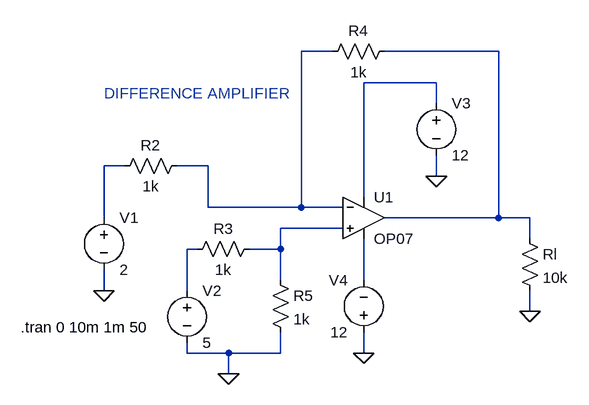
[diagram p0: schematic Difference Amplifier.asc]
Difference Amplifier.asc, the LTspice schematic file:
Version 4
SHEET 1 880 680
WIRE 272 -64 224 -64
WIRE 528 -64 352 -64
WIRE 432 -16 320 -16
WIRE 432 16 432 -16
WIRE -48 112 -80 112
WIRE 80 112 32 112
WIRE 432 128 432 96
WIRE 320 160 320 -16
WIRE 80 176 80 112
WIRE 224 176 224 -64
WIRE 224 176 80 176
WIRE 288 176 224 176
WIRE -80 192 -80 112
WIRE 528 192 528 -64
WIRE 528 192 352 192
WIRE 576 192 528 192
WIRE 288 208 192 208
WIRE 576 224 576 192
WIRE 64 240 48 240
WIRE 192 240 192 208
WIRE 192 240 144 240
WIRE 192 288 192 240
WIRE 320 288 320 224
WIRE -80 304 -80 272
WIRE 48 304 48 240
WIRE 576 336 576 304
WIRE 48 400 48 384
WIRE 112 400 48 400
WIRE 192 400 192 368
WIRE 192 400 112 400
WIRE 320 400 320 368
WIRE 112 432 112 400
FLAG 432 128 0
FLAG 576 336 0
FLAG -80 304 0
FLAG 112 432 0
FLAG 320 400 0
SYMBOL OpAmps\\OP07 320 128 R0
SYMATTR InstName U1
SYMBOL voltage 320 384 R180
WINDOW 0 24 96 Left 2
WINDOW 3 24 16 Left 2
SYMATTR InstName V4
SYMATTR Value 12
SYMBOL voltage 432 0 R0
SYMATTR InstName V3
SYMATTR Value 12
SYMBOL res 560 208 R0
SYMATTR InstName Rl
SYMATTR Value 10k
SYMBOL res 368 -80 R90
WINDOW 0 0 56 VBottom 2
WINDOW 3 32 56 VTop 2
SYMATTR InstName R4
SYMATTR Value 1k
SYMBOL res 160 224 R90
WINDOW 0 0 56 VBottom 2
WINDOW 3 32 56 VTop 2
SYMATTR InstName R3
SYMATTR Value 1k
SYMBOL res 48 96 R90
WINDOW 0 0 56 VBottom 2
WINDOW 3 32 56 VTop 2
SYMATTR InstName R2
SYMATTR Value 1k
SYMBOL voltage -80 176 R0
SYMATTR InstName V1
SYMATTR Value 2
SYMBOL res 176 272 R0
SYMATTR InstName R5
SYMATTR Value 1k
SYMBOL voltage 48 288 R0
SYMATTR InstName V2
SYMATTR Value 5
TEXT -208 360 Left 2 !.tran 0 10m 1m 50
TEXT -80 0 Left 2 ;DIFFERENCE AMPLIFIER

The netlist it stands for:
* Difference Amplifier.asc
XU1 N005 N001 N003 N007 N002 LT1001  ; OP07, pins In+ In- V+ V- OUT
V4 0 N007 12
V3 N003 0 12
Rl N002 0 10k
R4 N002 N001 1k
R3 N005 N006 1k
R2 N001 N004 1k
V1 N004 0 2
R5 N005 0 1k
V2 N006 0 5
.tran 0 10m 1m 50
* DIFFERENCE AMPLIFIER
.lib LTC.lib
.backanno
.end